# Altium project Rocket.PrjPcb
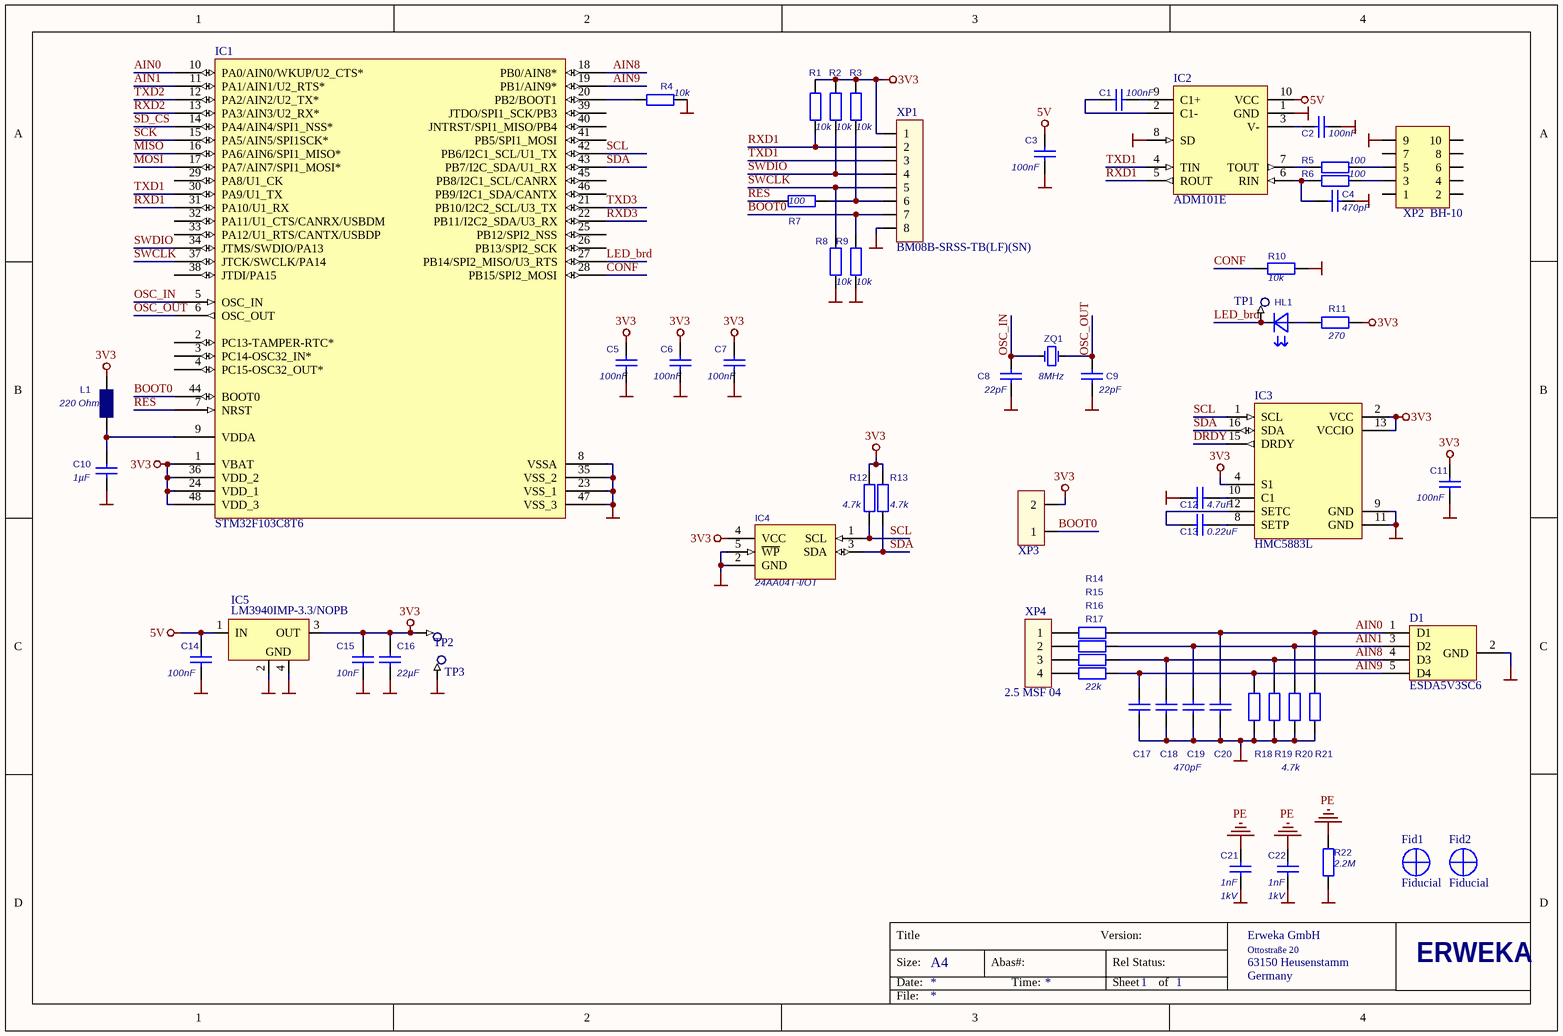
[diagram p0: Rocket_1.SchDoc]
1 sheet, 62 parts. Net scope: global (net labels, ports and power ports of the same name join across sheets).
Board file: Rocket.PcbDoc

## Sheet Rocket_1.SchDoc
size A4; SheetNumber: 1; SheetTotal: 1; PageSetup: Record=PageOptions|CenterHorizontal=True|CenterVertical=True|PrintScale=0.97|XCorrection=1.00|YCorrection=1.00|PrintKind=0|BorderSize=5000000|LeftOffset=0|BottomOffset=0|Orientation=2|PaperLength=1000|PaperWidth=1000|Scale=100|PaperSource=7|PrintQuality=-3|MediaType=1|DitherType=10|PrintScaleMode=1|PaperKind=A4|PaperIndex=9

### Parts
C1  100nF  [0805C]
C2  100nF  [0805C]
C3  100nF  [0805C]
C4  470pF  [0805C]
C5  100nF  [0805C]
C6  100nF  [0805C]
C7  100nF  [0805C]
C8  22pF  [0805C]
C9  22pF  [0805C]
C10  1µF  [0805C]
C11  100nF  [0805C]
C12  4.7uF  [0805C]
C13  0.22uF  [0805C]
C14  100nF  [0805C]
C15  10nF  [0805C]
C16  22µF  [C1206K]
C17  470pF  [0805C]
C18  470pF  [0805C]  (value not drawn)
C19  470pF  [0805C]  (value not drawn)
C20  470pF  [0805C]  (value not drawn)
C21  Voltage - Rated: 1kV  [C1812K]  (hidden comment: 1nF)
C22  Voltage - Rated: 1kV  [C1812K]  (hidden comment: 1nF)
D1  ESDA5V3SC6  [SOT23-5]
Fid1  Fiducial  [Fiducial]
Fid2  Fiducial  [Fiducial]
HL1  LED Grün  [LED-1206R]  (value not drawn)
IC1  STM32F103C8T6  [LQFP48_N]
IC2  ADM101E  [MSOP10]
IC3  HMC5883L  [LCC16]
IC4  24AA04T-I/OT  [SOT-23-5]
IC5  LM3940IMP-3.3/NOPB  [SOT-223]
L1  220 Ohm  [0805L]
R1  10k  [0805R]
R2  10k  [0805R]
R3  10k  [0805R]
R4  10k  [0805R]
R5  100  [0805R]
R6  100  [0805R]
R7  100  [0805R]
R8  10k  [0805R]
R9  10k  [0805R]
R10  10k  [0805R]
R11  270  [0805R]
R12  4.7k  [0805R]
R13  4.7k  [0805R]
R14  22k  [0805R]
R15  22k  [0805R]  (value not drawn)
R16  22k  [0805R]  (value not drawn)
R17  22k  [0805R]  (value not drawn)
R18  4.7k  [0805R]
R19  4.7k  [0805R]  (value not drawn)
R20  4.7k  [0805R]  (value not drawn)
R21  4.7k  [0805R]  (value not drawn)
R22  2.2M  [2512R]
TP1  Test point  [TESTP1]  (value not drawn)
TP2  Test point  [TESTP1]  (value not drawn)
TP3  Test point  [TESTP1]  (value not drawn)
XP1  BM08B-SRSS-TB(LF)(SN)  [SH8]
XP2  BH-10  [BH-10 SMD]
XP3  CON 1x2  [PLS-02]  (value not drawn)
XP4  2.5 MSF 04  [2.5 MSF 04]
ZQ1  8MHz  [ABM7]

### Nets
3V3: C5.2 C6.2 C7.2 C11.2 C15.2 C16.2 IC1.1(VBAT) IC1.24(VDD_1) IC1.36(VDD_2) IC1.48(VDD_3) IC3.2(VCC) IC3.4(S1) IC3.13(VCCIO) IC4.4(VCC) IC5.3(OUT) L1.2 R1.2 R2.2 R3.2 R11.1 R12.1 R13.1 TP2.1 XP1.1 XP3.2
5V: C3.2 C14.2 IC2.10(VCC) IC5.1(IN)
GND: C2.1 C3.1 C4.1 C5.1 C6.1 C7.1 C8.2 C9.2 C10.2 C11.1 C12.1 C14.1 C15.1 C16.1 C17.1 C18.1 C19.1 C20.1 C21.1 C22.1 D1.2(GND) IC1.8(VSSA) IC1.23(VSS_1) IC1.35(VSS_2) IC1.47(VSS_3) IC2.1(GND) IC2.8(SD) IC3.9(GND) IC3.11(GND) IC4.2(GND) IC4.5(~{WP}) IC5.2(GND) IC5.4(GND) R4.2 R8.1 R9.1 R10.2 R18.2 R19.2 R20.2 R21.2 R22.2 TP3.1 XP1.8 XP2.9
PE: C21.2 C22.2 R22.1
AIN0: C20.2 D1.1(D1) IC1.10(PA0/AIN0/WKUP/U2_CTS*) R14.2 R21.1
AIN1: C19.2 D1.3(D2) IC1.11(PA1/AIN1/U2_RTS*) R15.2 R20.1
AIN8: C18.2 D1.4(D3) IC1.18(PB0/AIN8*) R16.2 R19.1
AIN9: C17.2 D1.5(D4) IC1.19(PB1/AIN9*) R17.2 R18.1
BOOT0: IC1.44(BOOT0) R9.2 XP1.7 XP3.1
CONF: IC1.28(PB15/SPI2_MOSI) R10.1
DRDY: IC3.15(DRDY)
LED_brd: HL1.C IC1.27(PB14/SPI2_MISO/U3_RTS) TP1.1
MISO: IC1.16(PA6/AIN6/SPI1_MISO*)
MOSI: IC1.17(PA7/AIN7/SPI1_MOSI*)
OSC_IN: C8.1 IC1.5(OSC_IN) ZQ1.1(OSC1)
OSC_OUT: C9.1 IC1.6(OSC_OUT) ZQ1.2(OSC2)
RES: IC1.7(NRST) R7.1
RXD1: IC1.31(PA10/U1_RX) IC2.5(ROUT) R1.1 XP1.2
RXD2: IC1.13(PA3/AIN3/U2_RX*)
RXD3: IC1.22(PB11/I2C2_SDA/U3_RX)
SCK: IC1.15(PA5/AIN5/SPI1SCK*)
SCL: IC1.42(PB6/I2C1_SCL/U1_TX) IC3.1(SCL) IC4.1(SCL) R12.2
SD_CS: IC1.14(PA4/AIN4/SPI1_NSS*)
SDA: IC1.43(PB7/I2C_SDA/U1_RX) IC3.16(SDA) IC4.3(SDA) R13.2
SWCLK: IC1.37(JTCK/SWCLK/PA14) R8.2 XP1.5
SWDIO: IC1.34(JTMS/SWDIO/PA13) R2.1 XP1.4
TXD1: IC1.30(PA9/U1_TX) IC2.4(TIN) XP1.3
TXD2: IC1.12(PA2/AIN2/U2_TX*)
TXD3: IC1.21(PB10/I2C2_SCL/U3_TX)
NetC1_1: C1.1 IC2.9(C1+)
NetC1_2: C1.2 IC2.2(C1-)
NetC2_2: C2.2 IC2.3(V-)
NetC4_2: C4.2 IC2.6(RIN) R6.1
NetC10_1: C10.1 IC1.9(VDDA) L1.1
NetC12_2: C12.2 IC3.10(C1)
NetC13_1: C13.1 IC3.12(SETC)
NetC13_2: C13.2 IC3.8(SETP)
NetHL1_A: HL1.A R11.2
NetIC1_20: IC1.20(PB2/BOOT1) R4.1
NetIC2_7: IC2.7(TOUT) R5.1
NetR3_1: R3.1 R7.2 XP1.6
NetR5_2: R5.2 XP2.5
NetR6_2: R6.2 XP2.3
NetR14_1: R14.1 XP4.1
NetR15_1: R15.1 XP4.2
NetR16_1: R16.1 XP4.3
NetR17_1: R17.1 XP4.4

Not connected (* = marked no-connect by the designer): IC1 2(PC13-TAMPER-RTC*) 3(PC14-OSC32_IN*) 4(PC15-OSC32_OUT*) 25(PB12/SPI2_NSS) 26(PB13/SPI2_SCK) 29(PA8/U1_CK) 32(PA11/U1_CTS/CANRX/USBDM) 33(PA12/U1_RTS/CANTX/USBDP) 38(JTDI/PA15) 39(JTDO/SPI1_SCK/PB3) 40(JNTRST/SPI1_MISO/PB4) 41(PB5/SPI1_MOSI) 45(PB8/I2C1_SCL/CANRX) 46(PB9/I2C1_SDA/CANTX); IC3 3(NC) 5(NC) 6(NC) 7(NC) 14(NC); XP2 1 2 4 6 7 8 10

### Notes on the sheet
- Title
- Size:
- Date:
- A4
- Abas#:
- Time:
- Version:
- Rel Status:
- Sheet
- of
- Erweka GmbH
- Ottostraße 20
- 63150 Heusenstamm
- Germany
- ERWEKA
- File:

### Library data of the parts
C1-C3 C5-C9 C11 C14 C21 C22 = C CERAMIC: CAP CER; Supplier 1: Farnell
  C1-C3 C5-C7 C11 C14: Value: 100nF; Package / Case: 0805; Supplier Part Number 1: 2310706
  C8 C9: Value: 22pF; Package / Case: 0805; Supplier Part Number 1: 317500
  C21 C22: Value: 1nF; Package / Case: 1812; Supplier Part Number 1: 1886078
C4 C17-C20 = C CERAMIC: CAP CER; Tolerance %: ±1%; Voltage - Rated: 50V; Value: 470pF; Package / Case: 0805; Supplier 1: Farnell; Supplier Part Number 1: 1740646
C10 = C CERAMIC: CAP CER; Tolerance %: ±10%; Voltage - Rated: 50V; Value: 1µF; Package / Case: 0805; Supplier 1: Farnell; Supplier Part Number 1: 1735541
C12 C13 = C CERAMIC: CAP CER; Tolerance %: ±10%; Voltage - Rated: 35V; Supplier 1: Farnell; Package / Case: 0805
  C12: Value: 4.7uF
  C13: Value: 0.22uF
C15 = C CERAMIC: CAP CER; Tolerance %: ±10%; Voltage - Rated: 100V; Value: 10nF; Package / Case: 0805; Supplier 1: Farnell; Supplier Part Number 1: 1658874
C16 = C CERAMIC: CAP CER; Tolerance %: ±10%; Voltage - Rated: 25V; Value: 22µF; Package / Case: 1206; Supplier 1: Farnell; Supplier Part Number 1: 1797010RL
D1 = ESDA5V3SC6: Quad ESD protection diode; Manufacture: ST MICROELECTRONICS; Power [Watt]: 500; Voltage - Rated: 5.3V; Manufacture Part Number: ESDA5V3SC6; Package / Case: SOT-23-6; Supplier 1: Farnell; Supplier Part Number 1: 1749268; Value: ESDA5V3SC6
HL1 = LED: LED 1206 Grün; Package / Case: 1206; Value: LED Grün; Supplier 1: Farnell; Supplier Part Number 1: 2322085; Supplier 2: Mouser; Supplier Part Number 2: 710-150120GS75000
IC1 = STM32F103C8T6: 32-Bit ARM Cortex-M3, 72 MHz, 64 KB, 20 KB, 48, VFQFPN; Manufacture: ST MICROELECTRONICS; Voltage - Rated: 3.3V; Manufacture Part Number: STM32F103C8T6; Package / Case: LQFP48; PDF: http://www.farnell.com/datasheets/1963088.pdf; Supplier 1: Farnell; Supplier Part Number 1: 1447637; Value: STM32F103C8T6
IC2 = ADM101E: +5V, 1-Channel RS-232 Driver/Receiver
IC3 = HMC5883L: 3-Axis Digital Compass; Manufacture: HONEYWELL; Manufacture Part Number: HMC5883L-TR; Package / Case: LCC16; Supplier 1: Farnell; Supplier Part Number 1: 1971743
IC4 = 24AA04: 4K I2C Serial EEPROM; Package / Case: SOT23-5; Supplier 1: Farnell; Supplier Part Number 1: 1331277RL; Value: 24AA04T-I/OT
IC5 = LM3940: 1A Low-Dropout Regulator for 5V to 3.3V Conversion; Package / Case: SOT-223/SC73; Supplier 1: Farnell; Supplier Part Number 1: 1469104; Value: LM3940IMP-3.3/NOPB
L1 = FERRITE CHIP 220 OHM: FERRITE CHIP 220 OHM 2000MA 0805; Manufacture: Würth Elektronik; Manufacture Part Number: BLM21PG221SN1D; Value: 220 Ohm; Package / Case: 0805; Supplier 1: Farnell; Supplier Part Number 1: 1515661
R1-R21 = Resistor: Tolerance %: ±1%; Package / Case: 0805; Supplier 1: Farnell
  R1-R4 R8-R10: Value: 10k; Supplier Part Number 1: 2447553
  R5-R7: Value: 100; Supplier Part Number 1: 2073605
  R11: Value: 270; Supplier Part Number 1: 2074422
  R12 R13 R18-R21: Value: 4.7k; Supplier Part Number 1: 2447672
  R14-R17: Value: 22k
R22 = Resistor: Manufacture: MULTICOMP; Tolerance %: ±1%; Value: 2.2M; Package / Case: 2512; Supplier 1: Farnell; Supplier Part Number 1: 1887878
XP1 = CON 1x8 ISP: Connector ISP SMD; Manufacture: JST; Current: 1A; Voltage - Rated: 50VDC; Manufacture Part Number: BM08B-SRSS-TB(LF)(SN); Package / Case: SMD 8Pin; Supplier 1: Farnell; Supplier 2: Farnell; Supplier Part Number 1: 1679134; Supplier Part Number 2: 8729018; Value: BM08B-SRSS-TB(LF)(SN)
XP2 = CON 2x5: Connector
XP3 = CON 1x2: Connector
XP4 = 2.5 MSF 04: Connector; Manufacture: KARL LUMBERG; Current: 5 A; Voltage - Rated: 160VAC; Manufacture Part Number: 2.5 MSF 04; Value: 2.5 MSF 04
ZQ1 = Quarz 25MHz 6 x 3.5: QUARZ, 25MHZ, ABRACON  ABM7-25.000MHZ-D2Y-T, 18PF, SMD; Manufacture Part Number: ABM7-8.000MHZ-D2Y-T; Note: 8MHz 22pF; Tolerance %: 30ppm; Supplier 1: Farnell; Manufacture: ABRACON; Package / Case: ABM7 6mm x 3.5mm; PackageReference: ABM7; partNo: ABM7-8.000MHZ-D2Y-T; Alias1: quarz; Supplier Part Number 1: 2101337; Value: 8MHz